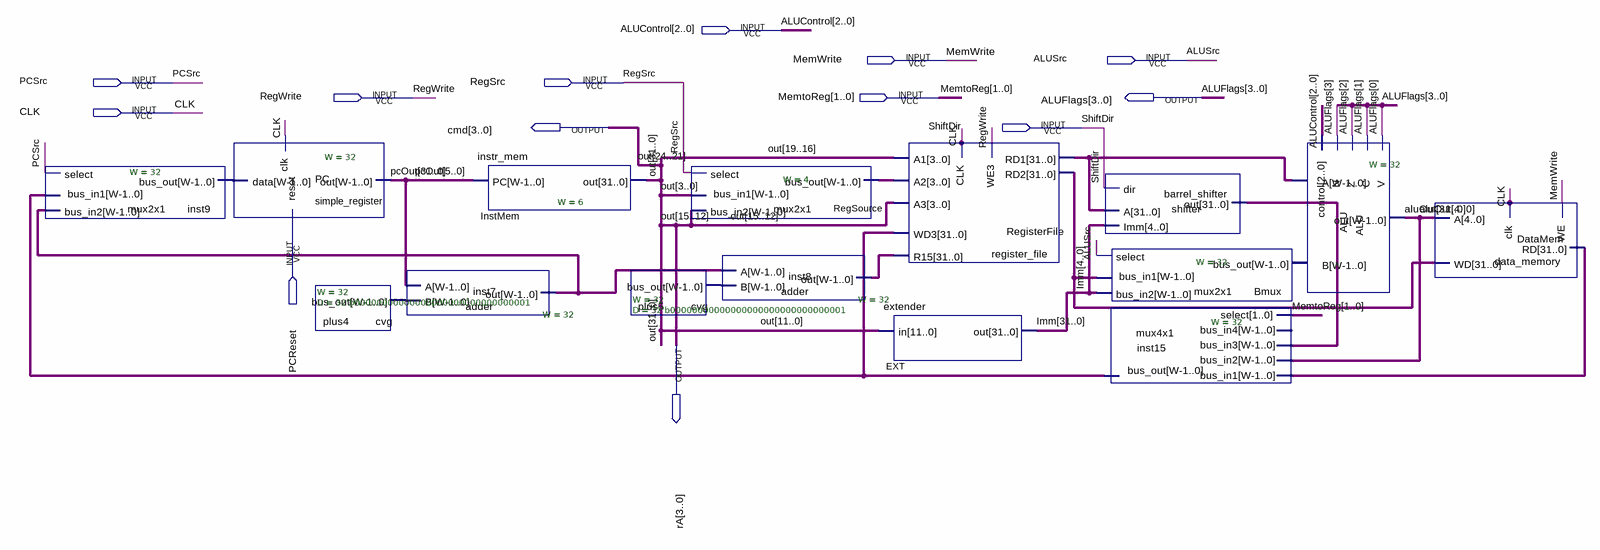
[diagram p0: schematic sheet]
// Quartus schematic datapath.bdf as structural Verilog: 15 symbols, 13 pins
module datapath (
  input  [2:0] ALUControl,
  input  MemWrite,
  input  ALUSrc,
  input  PCSrc,
  input  RegSrc,
  input  RegWrite,
  input  [1:0] MemtoReg,
  input  CLK,
  input  ShiftDir,
  input  PCReset,
  output [3:0] ALUFlags,
  output [3:0] cmd,
  output [3:0] rA
);

  wire [3:0] RegSource_bus_out;
  wire [31:0] aluOut, Bmux_bus_out, DataMem_rd, Imm, inst7_out, inst8_out, inst9_bus_out, inst15_bus_out,
       out, pcOut, plus4_bus_out, plus5_bus_out, RegisterFile_rd1, RegisterFile_rd2, shifter_out;

  mux2x1 #(.W(32)) inst9 (.bus_in1(inst15_bus_out), .bus_in2(inst7_out), .select(PCSrc), .bus_out(inst9_bus_out));
  simple_register #(.W(32)) PC (.clk(CLK), .reset(PCReset), .data(inst9_bus_out), .out(pcOut));
  cvg #(.W(32), .D(32'b00000000000000000000000000000001)) plus4 (.bus_out(plus4_bus_out));
  adder #(.W(32)) inst7 (.A(pcOut), .B(plus4_bus_out), .out(inst7_out));
  instr_mem #(.W(6)) InstMem (.PC(pcOut[5:0]), .out({out[31:25], cmd, out[20:16], rA, out[11:0]}));
  cvg #(.W(32), .D(32'b00000000000000000000000000000001)) plus5 (.bus_out(plus5_bus_out));
  mux2x1 #(.W(4)) RegSource (.bus_in1(out[3:0]), .bus_in2(rA), .select(RegSrc), .bus_out(RegSource_bus_out));
  adder #(.W(32)) inst8 (.A(inst7_out), .B(plus5_bus_out), .out(inst8_out));
  register_file RegisterFile (
    .CLK(CLK), .A1(out[19:16]), .A2(RegSource_bus_out), .A3(rA), .WE3(RegWrite), .WD3(inst15_bus_out),
    .R15(inst8_out), .RD1(RegisterFile_rd1), .RD2(RegisterFile_rd2));
  extender EXT (.in(out[11:0]), .out(Imm));
  barrel_shifter shifter (.A(RegisterFile_rd1), .dir(ShiftDir), .Imm(Imm[4:0]), .out(shifter_out));
  mux2x1 #(.W(32)) Bmux (.bus_in1(RegisterFile_rd2), .bus_in2(Imm), .select(ALUSrc), .bus_out(Bmux_bus_out));
  mux4x1 #(.W(32)) inst15 (
    .bus_in1(DataMem_rd), .bus_in2(aluOut), .bus_in3(shifter_out), .select(MemtoReg), .bus_out(inst15_bus_out));  // open: bus_in4
  ALU #(.W(32)) ALU (
    .control(ALUControl), .A(RegisterFile_rd1), .B(Bmux_bus_out), .N(ALUFlags[3]), .Z(ALUFlags[2]),
    .C(ALUFlags[1]), .V(ALUFlags[0]), .out(aluOut));
  data_memory DataMem (.clk(CLK), .WE(MemWrite), .WD(RegisterFile_rd2), .A(aluOut[4:0]), .RD(DataMem_rd));

  // Other names for the same wires on the sheet: out (some bits) = {cmd, rA}
endmodule
